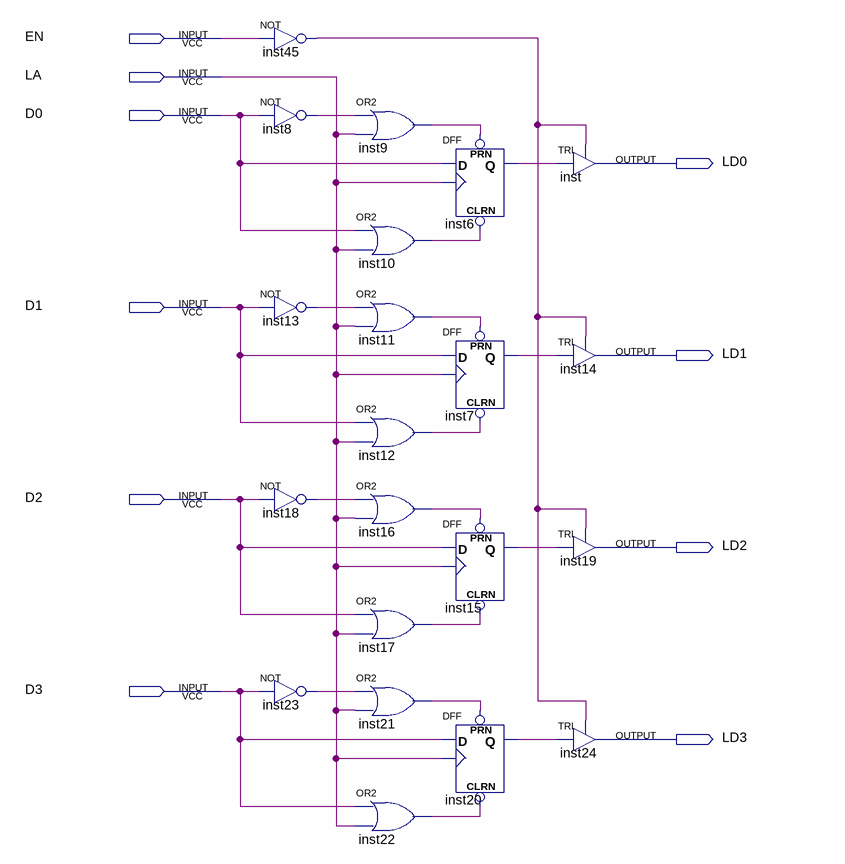
[diagram p0: schematic sheet]
// Quartus schematic 4latchhole.bdf as structural Verilog: 21 symbols, 10 pins
module \4latchhole  (
  input  EN,
  input  LA,
  input  D0,
  input  D1,
  input  D2,
  input  D3,
  output LD0,
  output LD1,
  output LD2,
  output LD3
);

  wire inst6_q, inst7_q, inst8_out, inst9_out, inst10_out, inst11_out, inst12_out, inst13_out, inst15_q,
       inst16_out, inst17_out, inst18_out, inst20_q, inst21_out, inst22_out, inst23_out, inst45_out;

  not inst45 (inst45_out, EN);
  not inst8 (inst8_out, D0);
  not inst13 (inst13_out, D1);
  not inst18 (inst18_out, D2);
  not inst23 (inst23_out, D3);
  or inst9 (inst9_out, inst8_out, LA);
  or inst10 (inst10_out, D0, LA);
  or inst11 (inst11_out, inst13_out, LA);
  or inst12 (inst12_out, D1, LA);
  or inst16 (inst16_out, inst18_out, LA);
  or inst17 (inst17_out, D2, LA);
  or inst21 (inst21_out, inst23_out, LA);
  or inst22 (inst22_out, D3, LA);
  DFF inst6 (.CLRN(inst10_out), .CLK(LA), .D(D0), .PRN(inst9_out), .Q(inst6_q));
  DFF inst7 (.CLRN(inst12_out), .CLK(LA), .D(D1), .PRN(inst11_out), .Q(inst7_q));
  DFF inst15 (.CLRN(inst17_out), .CLK(LA), .D(D2), .PRN(inst16_out), .Q(inst15_q));
  DFF inst20 (.CLRN(inst22_out), .CLK(LA), .D(D3), .PRN(inst21_out), .Q(inst20_q));
  TRI inst (.IN(inst6_q), .OE(inst45_out), .OUT(LD0));
  TRI inst14 (.IN(inst7_q), .OE(inst45_out), .OUT(LD1));
  TRI inst19 (.IN(inst15_q), .OE(inst45_out), .OUT(LD2));
  TRI inst24 (.IN(inst20_q), .OE(inst45_out), .OUT(LD3));
endmodule
